# EAGLE design opam (EAGLE 6.6.0)
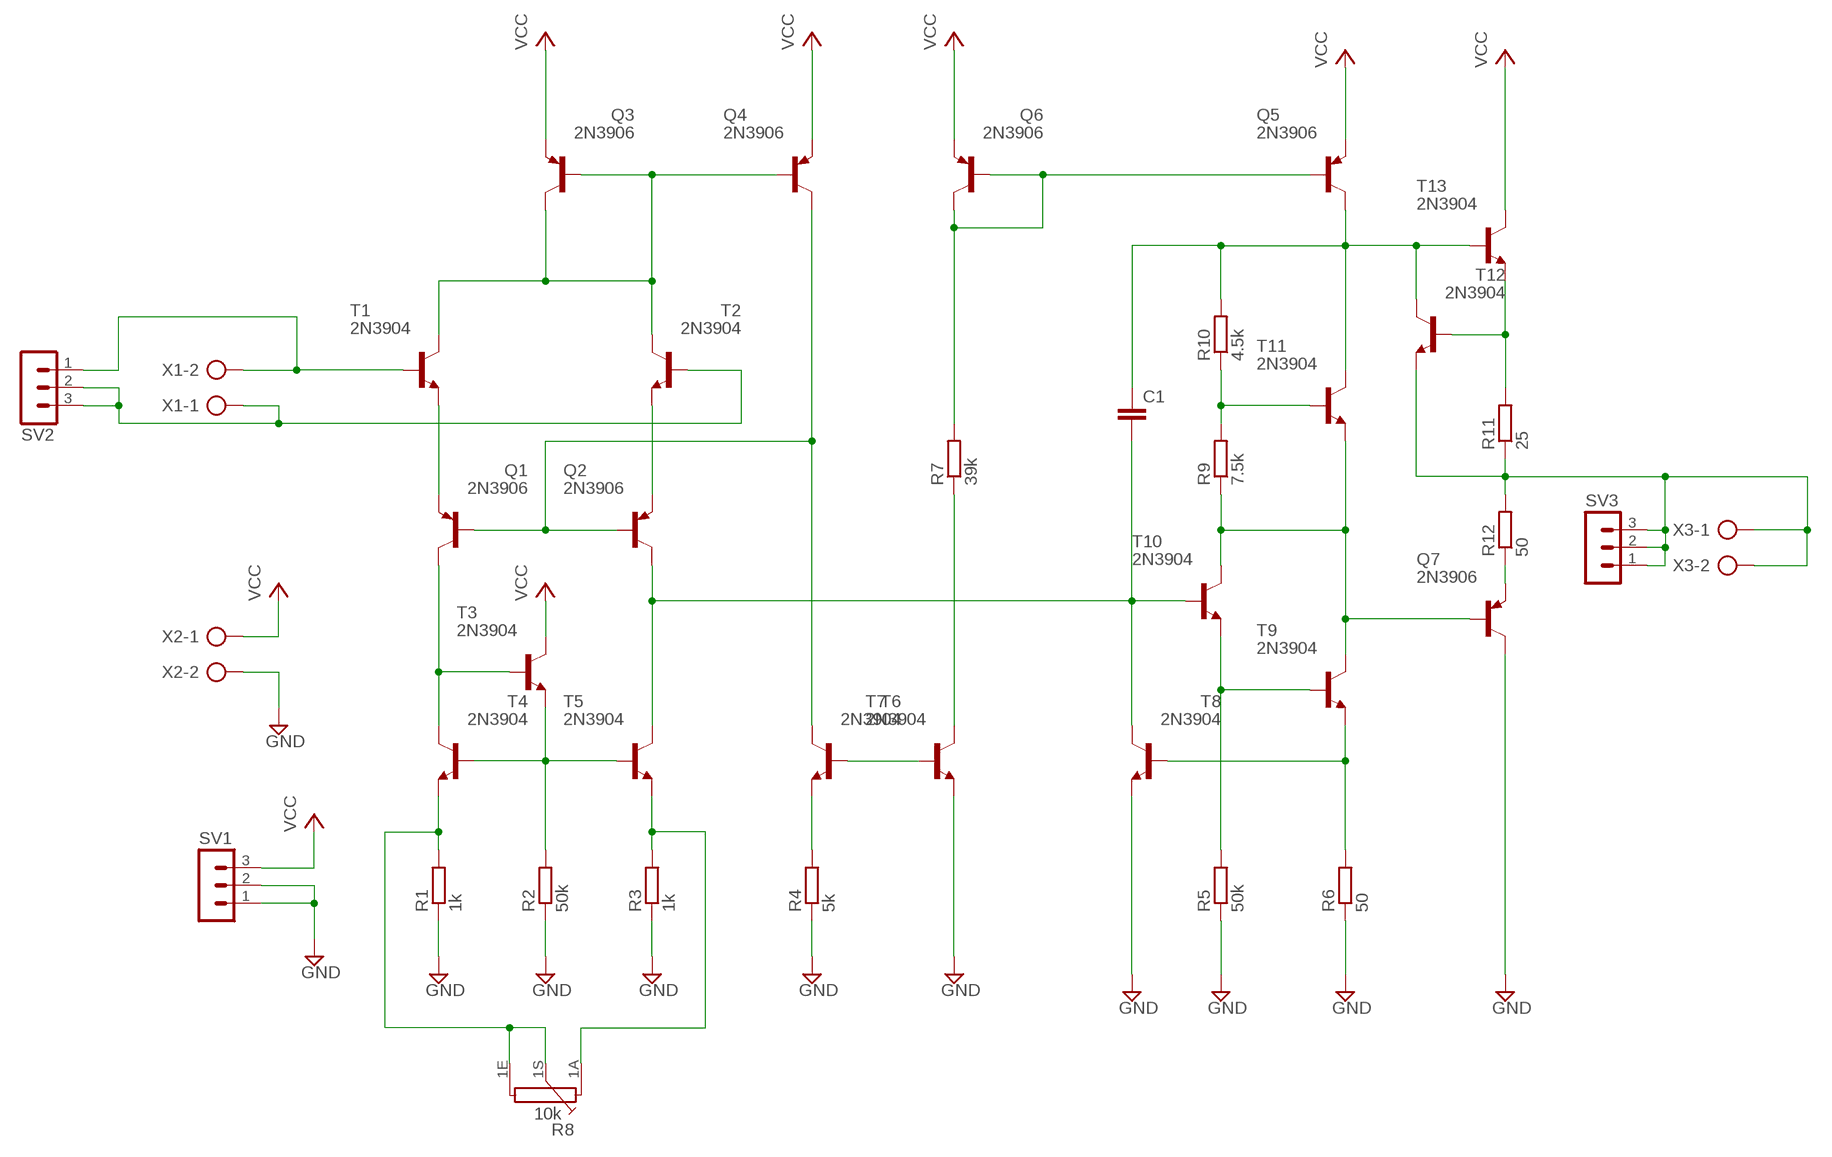
[diagram p0: schematic, sheet 1]

## Parts
C1  C2.5/5  [C2.5-5]
Q1  2N3906  [TO92]
Q2  2N3906  [TO92]
Q3  2N3906  [TO92]
Q4  2N3906  [TO92]
Q5  2N3906  [TO92]
Q6  2N3906  [TO92]
Q7  2N3906  [TO92]
R1  1k  R-EU_0309/12  [0309/12]
R2  50k  R-EU_0309/12  [0309/12]
R3  1k  R-EU_0309/12  [0309/12]
R4  5k  R-EU_0309/12  [0309/12]
R5  50k  R-EU_0309/12  [0309/12]
R6  50  R-EU_0309/12  [0309/12]
R7  39k  R-EU_0309/12  [0309/12]
R8  10k  PC16S  [PC16S]
R9  7.5k  R-EU_0309/12  [0309/12]
R10  4.5k  R-EU_0309/12  [0309/12]
R11  25  R-EU_0309/12  [0309/12]
R12  50  R-EU_0309/12  [0309/12]
SV1  MA03-1  [MA03-1]
SV2  MA03-1  [MA03-1]
SV3  MA03-1  [MA03-1]
T1  2N3904  [TO92]
T2  2N3904  [TO92]
T3  2N3904  [TO92]
T4  2N3904  [TO92]
T5  2N3904  [TO92]
T6  2N3904  [TO92]
T7  2N3904  [TO92]
T8  2N3904  [TO92]
T9  2N3904  [TO92]
T10  2N3904  [TO92]
T11  2N3904  [TO92]
T12  2N3904  [TO92]
T13  2N3904  [TO92]
X1  AK500/2-H  [AK500/2-H]
X2  AK500/2-H  [AK500/2-H]
X3  AK500/2-H  [AK500/2-H]

## Nets
GND: Q7.1(C) R1.1 R2.1 R3.1 R4.1 R5.1 R6.1 SV1.1 SV1.2 T7.3(E) T8.3(E) X2.2
N$1: R5.2 T9.2(B) T10.3(E)
N$2: R2.2 T3.3(E) T4.2(B) T5.2(B)
N$3: R3.2 R8.1A T5.3(E)
N$4: SV2.1 T1.2(B) X1.2
N$5: Q1.1(C) T3.2(B) T4.1(C)
N$6: Q1.3(E) T1.3(E)
N$7: Q2.3(E) T2.3(E)
N$8: Q1.2(B) Q2.2(B) Q4.1(C) T6.1(C)
N$9: Q3.1(C) Q3.2(B) Q4.2(B) T1.1(C) T2.1(C)
N$10: R6.2 T8.2(B) T9.3(E)
N$11: R1.2 R8.1E R8.1S T4.3(E)
N$12: Q7.3(E) R12.1
N$13: R4.2 T6.3(E)
N$14: T6.2(B) T7.2(B)
N$15: R7.1 T7.1(C)
N$16: Q5.2(B) Q6.1(C) Q6.2(B) R7.2
N$18: C1.2 Q2.1(C) T5.1(C) T8.1(C) T10.2(B)
N$19: Q7.2(B) R9.1 T9.1(C) T10.1(C) T11.3(E)
N$20: C1.1 Q5.1(C) R10.2 T11.1(C) T12.1(C) T13.2(B)
N$21: R11.2 T12.2(B) T13.3(E)
N$22: R9.2 R10.1 T11.2(B)
N$23: SV2.2 SV2.3 T2.2(B) X1.1
N$26: R11.1 R12.2 SV3.1 SV3.2 SV3.3 T12.3(E) X3.1 X3.2
VCC: Q3.3(E) Q4.3(E) Q5.3(E) Q6.3(E) SV1.3 T3.1(C) T13.1(C) X2.1

## Library data of the parts
C1 = capacitor-wima:C: CAPACITOR naming: grid - package width
Q1-Q7 = transistor-pnp:2N3906: PNP Transistor
R1-R7 R9-R12 = rcl:R-EU_: RESISTOR, European symbol
R8 = piher:PC16S: POTENTIOMETER single carbon potentiometer, 16 mm, S3ROH; OC_FARNELL: 4452940; OC_NEWARK: unknown
SV1-SV3 = con-lstb:MA03-1: PIN HEADER; OC_FARNELL: unknown; OC_NEWARK: unknown
T1-T13 = transistor:2N3904: NPN TRANSISTOR
X1-X3 = con-ptr500:AK500/2-H: CONNECTOR Aug. 2004 / PTR Meßtechnik: Die Bezeichnung der Serie AK505 wurde geändert. Es handelt sich hierbei um AK500 in horizontaler Ausführung.; OC_FARNELL: unknown; OC_NEWARK: unknown

## Board
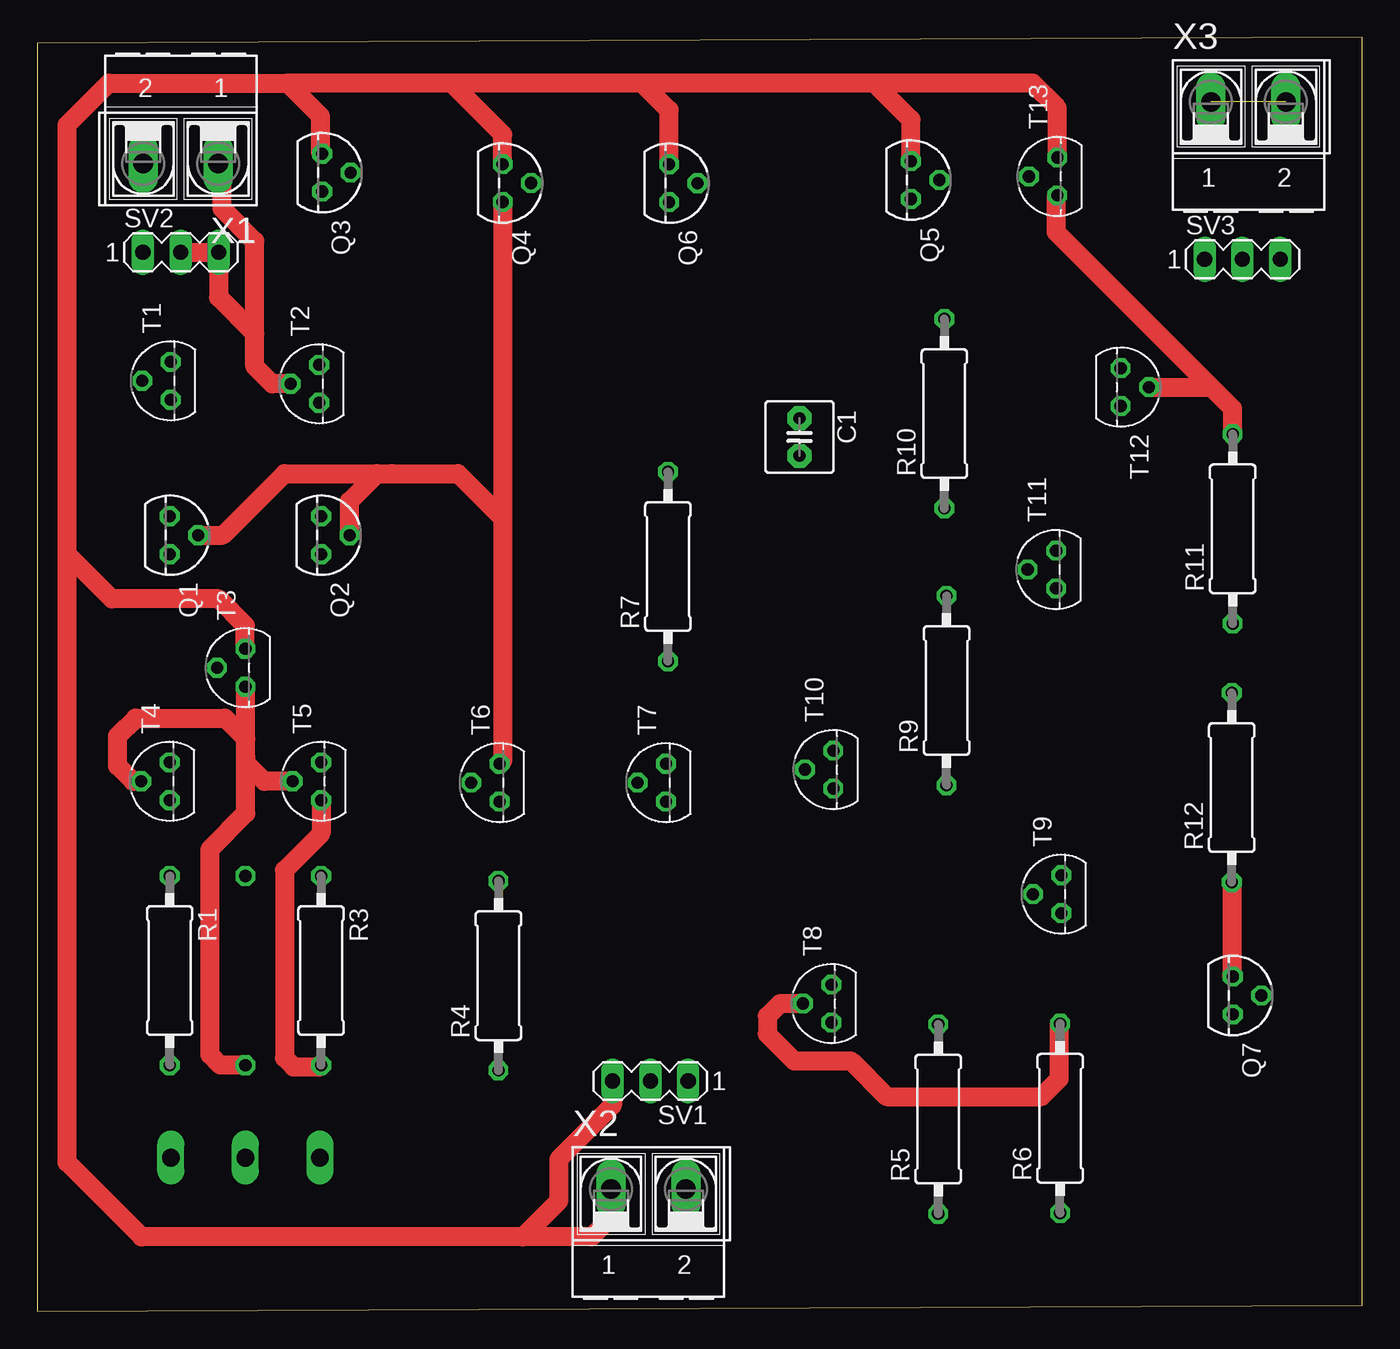
[diagram p1: board, top side]
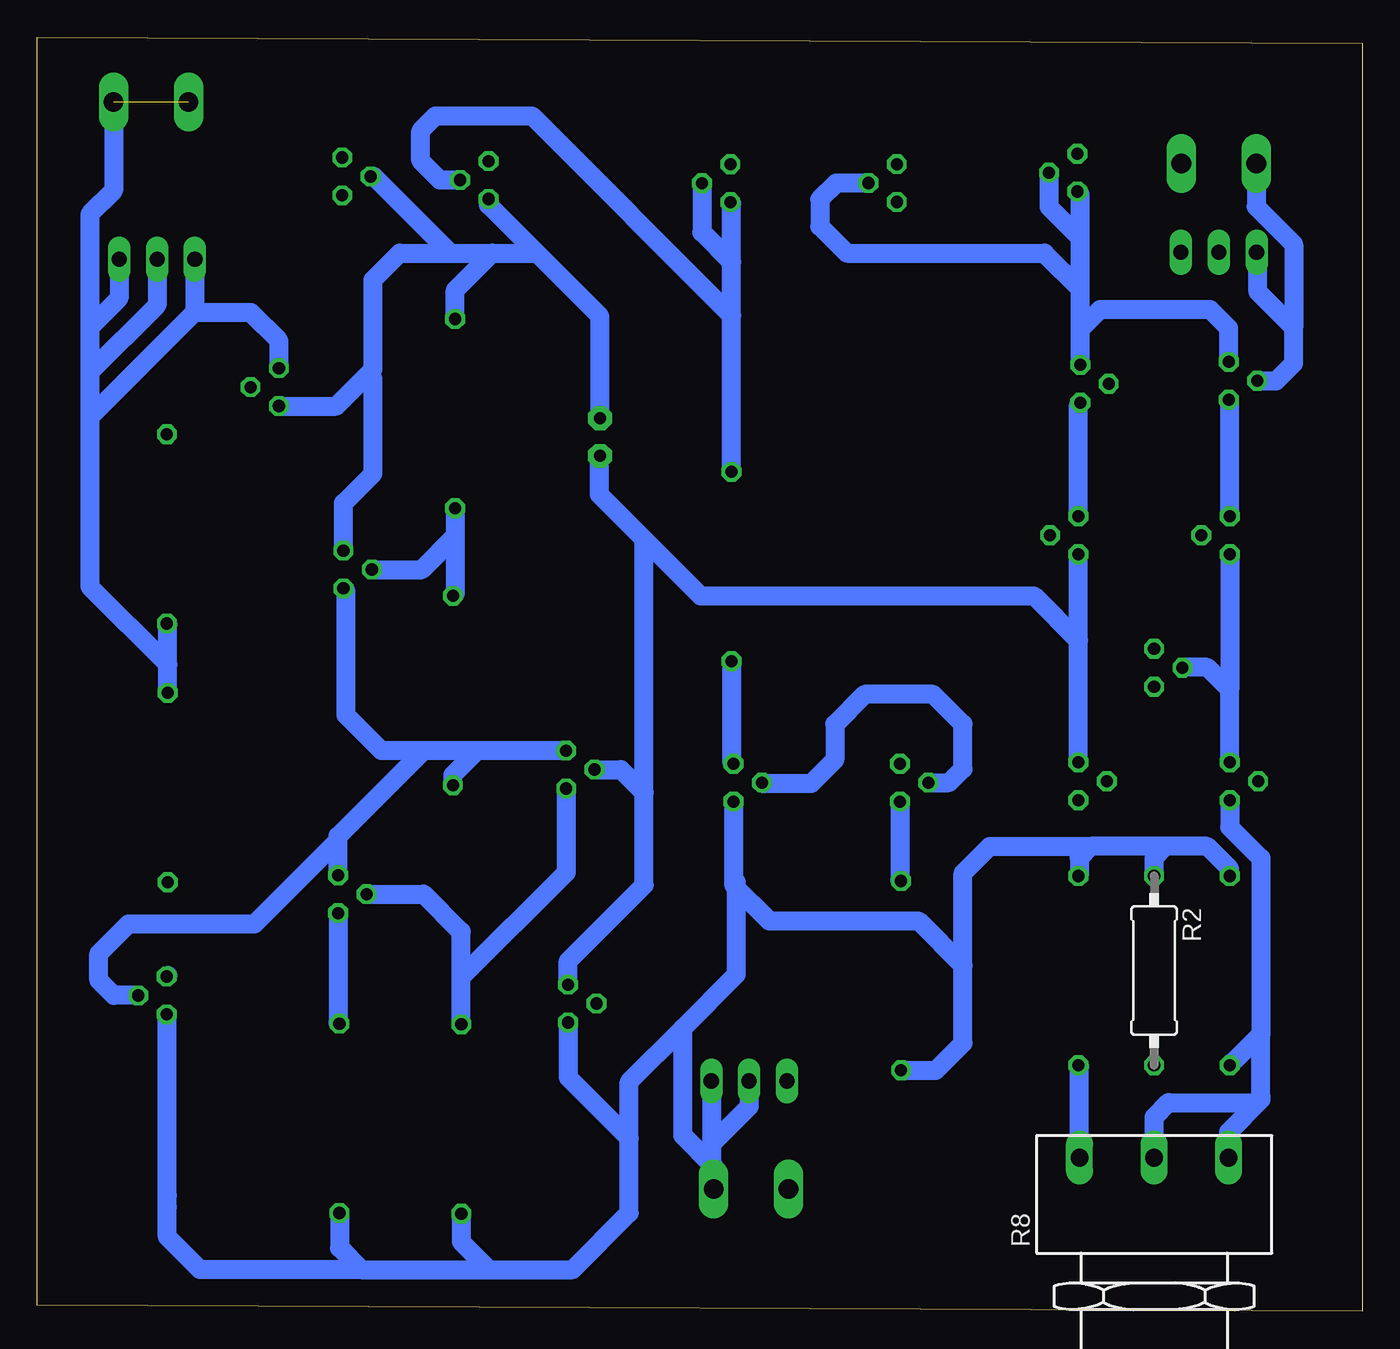
[diagram p2: board, bottom side, seen from below]

Size 88.93 x 85.48 mm. Coordinates in mm from the lower left corner, seen from the top.
Outline: 0,0 88.93,0.4 88.93,85.48 0,85.08 0,0
Copper layers (1*16): Top 0.035mm / dielectric 1.5mm / Bottom 0.035mm
Design rules "default": minimum track width 10mil, minimum drill 24mil, track to track 8mil, track to pad 8mil, pad to pad 8mil, via to via 8mil, smd to smd 8mil, copper to edge 40mil, drill to drill 8mil, minimum pad ring 10mil, minimum via ring 8mil, stop-mask expansion 4mil, vias tented up to drill 0mil, thermal gap 10mil

### Footprints (pad centres in the part's own frame; a part is rotated, then mirrored left to right if it is on the bottom)
C2.5-5 = drill 0.813 pad 1.6 octagon: 1 -1.27,0; 2 1.27,0
TO92 = drill 0.813 octagon: 1 1.27,0; 2 0,1.905; 3 -1.27,0
0309/12 = drill 0.813 octagon: 1 -6.35,0; 2 6.35,0
PC16S = drill 1.2 long: 1A -5,6.5; 1E 5,6.5; 1S 0,6.5
MA03-1 = drill 1.016 long: 1 -2.54,0; 2 0,0; 3 2.54,0
AK500/2-H = drill 1.321 long: 1 -2.515,0; 2 2.515,0

### Placement (x,y rotation side)
C1  51.16,58.66 270 top
Q1  8.89,52.07 270 top
Q2  19.05,52.07 270 top
Q3  19.12,76.4 270 top
Q4  31.24,75.7 270 top
Q5  58.64,75.9 270 top
Q6  42.41,75.69 270 top
Q7  80.24,21.19 270 top
R1  8.89,22.86 270 top
R2  13.97,22.86 270 bottom
R3  19.05,22.86 270 top
R4  30.95,22.52 90 top
R5  60.47,12.9 90 top
R6  68.65,12.95 90 top
R7  42.33,49.97 90 top
R8  13.97,3.81 0 bottom
R9  61.03,41.65 90 top
R10  60.88,60.23 90 top
R11  80.23,52.5 90 top
R12  80.17,35.14 90 top
SV1  41.15,15.45 180 top
SV2  9.63,71.05 0 top
SV3  80.89,70.58 0 top
T1  8.96,62.43 90 top
T2  18.92,62.23 90 top
T3  13.97,43.18 90 top
T4  8.89,35.56 90 top
T5  19.05,35.56 90 top
T6  31.03,35.47 90 top
T7  42.2,35.47 90 top
T8  53.3,20.65 90 top
T9  68.74,27.99 90 top
T10  53.43,36.35 90 top
T11  68.38,49.77 90 top
T12  72.71,62.01 270 top
T13  68.46,76.14 90 top
X1  9.63,77 180 top
X2  41.02,8.2 0 top
X3  81.29,81.14 0 top

### Tracks (layer width: path | path; a pad name or v marks a point on that pad's centre or on a via)
GND
  Bottom 1.27: R1.1 8.89,29.69 10.4,31.2 13.2,31.2 | 13.2,31.2 18.2,31.2 | 18.2,31.2 19,30.4 19,29.26 R3.1 | R2.1 13.97,30.43 13.2,31.2 | R4.1 28.63,16.17 26.8,18 26.8,23.2 | 26.8,23.2 26.8,29.4 25,31.2 18.2,31.2 | T7.3 42.2,29 | 42.2,29 42.2,28.6 39.8,26.2 29.8,26.2 26.8,23.2 | 45.6,19 45.6,11.8 43.53,9.73 X2.2 43.69,8.36 43.69,11.2 | 45.6,19 42,22.6 42,28.8 42.2,29 | SV1.1 43.69,11.2 | SV1.2 41.15,13.74 43.69,11.2 | 67.2,2.8 58.6,2.8 | 58.6,2.8 53,2.8 49.2,6.6 49.2,11.6 | 49.2,11.6 49.2,15.4 45.6,19 | T8.3 53.3,15.7 49.2,11.6 | R5.1 60.47,4.67 58.6,2.8 | Q7.1 80.24,7.8 | 80.24,7.8 80.24,7.04 80.2,7 | R6.1 68.65,4.25 67.2,2.8 | 67.2,2.8 78,2.8 80.2,5 80.2,7.76 80.24,7.8
N$1
  Bottom 1.27: R5.2 60.47,22.4 | 60.47,22.4 60.47,25.47 63,28 63.01,27.99 T9.2 | T10.3 53.43,29.44 60.47,22.4
N$2
  Top 1.27: T4.2 6.44,35.56 5.4,36.6 5.4,38.6 6.6,39.8 12.6,39.8 14,38.4 | 14,38.4 14,41.88 T3.3 | T5.2 15.24,35.56 14,36.8 | 14,36.8 14,37.2 14,38.4 | R2.2 12.29,16.51 11.6,17.2 11.6,31 14,33.4 14,36.8
N$3
  Top 1.27: T5.3 19.05,32.05 16.6,29.6 16.6,17 17.2,16.4 18.94,16.4 R3.2
  Bottom 1.27: R8.1A 18.97,16.43 R3.2
N$4
  Bottom 1.27: T1.2 5.77,62.43 4.6,63.6 4.6,65.2 4.6,66 | 4.6,66 7,68.4 7,71.14 | 7,71.6 7,71.14 | 7,71.14 SV2.1 | X1.2 7.12,74.11 4.6,71.6 4.6,66
N$5
  Bottom 1.27: T4.1 8.89,40.8 8.89,41.69 | 8.89,41.69 10.4,43.2 12.04,43.2 T3.2 | Q1.1 8.89,41.69
N$6
  Bottom 1.27: Q1.3 8.89,61.09 T1.3
N$7
  Bottom 1.27: Q2.3 19.05,60.83 T2.3
N$8
  Top 1.27: Q4.1 31.24,53.2 | 31.24,53.2 31.24,36.95 T6.1 | Q1.2 12.47,52.07 16.6,56.2 22.8,56.2 | Q2.2 20.95,54.35 22.8,56.2 | 22.8,56.2 23.8,56.2 28.24,56.2 31.24,53.2
N$9
  Bottom 1.27: T1.1 8.96,65.96 10.2,67.2 17.6,67.2 18.92,65.88 | T2.1 18.92,65.88 | 18.92,65.88 18.92,68.6 | 18.92,68.6 18.92,72 | 18.92,72 18.92,74.93 Q3.1 | Q3.2 21.02,74.11 18.92,72 | Q4.2 35.3,75.7 36.4,74.6 36.4,72.8 34.6,71 21.32,71 18.92,68.6
N$10
  Top 1.27: T8.2 49.85,20.65 49,19.8 49,18.6 50.8,16.8 54.6,16.8 57,14.4 67.4,14.4 68.6,15.6 68.6,19.25 R6.2
  Bottom 1.27: T9.3 68.74,19.39 R6.2
N$11
  Bottom 1.27: T4.3 8.89,32.49 6.8,30.4 6.8,18.6 | 6.8,18.6 R1.2 | R8.1E 8.97,12.03 6.8,14.2 6.8,14.4 | 6.8,14.4 6.8,18.6 | R8.1S 13.97,13.03 13,14 7.2,14 6.8,14.4
N$12
  Top 1.27: R12.1 80.17,22.53 Q7.3
  Bottom 1.27: 80.17,22.53 Q7.3
N$13
  Bottom 1.27: T6.3 31.03,28.95 R4.2
N$14
  Bottom 1.27: T6.2 27.73,35.47 26.8,36.4 26.8,39.4 28.8,41.4 33.4,41.4 35.4,39.4 35.4,37 37,35.4 40.23,35.4 T7.2
N$15
  Bottom 1.27: R7.1 42.33,36.87 T7.1
N$16
  Bottom 1.27: R7.2 42.33,66.8 | 42.33,66.8 42.33,70.4 | 42.33,70.4 42.33,74.34 Q6.1 | Q6.2 44.31,72.39 42.33,70.4 | Q5.2 61.9,75.9 63.2,77.2 63.2,79.2 62.2,80.2 55.73,80.2 42.33,66.8
N$18
  Bottom 1.27: T5.1 19.05,45 | 19.05,45 Q2.1 | T8.1 53.3,23.5 48.2,28.6 48.2,34.8 | 48.2,34.8 48.2,51.8 | 48.2,51.8 51.2,54.8 51.2,57.35 C1.2 | T10.2 49.75,36.35 48.2,34.8 | 48.2,51.8 44.4,48 22.05,48 19.05,45
N$19
  Bottom 1.27: T10.1 59.4,37.62 | 59.4,37.62 63,37.62 | 63,37.62 65.82,37.62 68.2,40 68.2,48.32 T11.3 | T9.1 68.74,31.6 | 68.74,31.6 68.74,31.88 63,37.62 | R9.1 61.03,35.99 59.4,37.62 | Q7.2 83.79,21.19 84.8,22.2 84.8,24 82.8,26 74.34,26 68.74,31.6
N$20
  Bottom 1.27: C1.1 51.16,66.76 55.4,71 | T13.2 66.34,76.14 61.2,71 | 61.2,71 58.4,71 | 58.4,71 55.4,71 | Q5.1 58.64,74.24 55.4,71 | R10.2 60.88,68.52 58.4,71 | T12.1 68.86,60.74 66.7,62.9 | 66.7,62.9 66.4,63.2 66.4,69.2 64.6,71 61.2,71 | T11.1 68.38,54.22 66.4,56.2 66.4,62.6 66.7,62.9
N$21
  Top 1.27: R11.2 80.23,60.57 78.9,61.9 78.79,62.01 | 78.79,62.01 68.4,72.4 68.4,74.81 T13.3 | T12.2 78.79,62.01
N$22
  Bottom 1.27: R10.1 60.88,52 | 60.88,52 60.88,48.15 R9.2 | T11.2 63.11,49.77 60.88,52
N$23
  Top 1.27: T2.2 15.77,62.23 14.6,63.4 14.6,65.6 | 14.6,65.6 14.6,71.8 12.4,74 12.4,76.75 X1.1 | SV2.2 SV2.3 12.17,68.03 14.6,65.6
N$26  (1 unrouted)
  Bottom 1.27: R12.2 80.17,43.4 | 80.17,43.4 80.17,46.09 R11.1 | X3.2 83.81,75.19 85.4,73.6 85.4,66 | 85.4,66 85.4,63 | 85.4,63 85.4,60 | 85.4,60 85.4,48.63 80.17,43.4 | SV3.3 83.43,67.97 85.4,66 | SV3.2 80.89,67.51 85.4,63 | SV3.1 78.35,67.05 78.4,67 | 85.4,60 78.9,66.5 78.4,67 | T12.3 72.71,65.11 74.6,67 78.4,67
VCC
  Top 1.27: T3.1 13.97,46.03 12.2,47.8 5,47.8 2,50.8 | 2,50.8 2,79.6 4.8,82.4 16.8,82.4 | 16.8,82.4 19,80.2 19,77.79 Q3.3 | Q4.3 31.24,78.96 27.8,82.4 | 27.8,82.4 16.8,82.4 | Q6.3 42.41,80.59 40.6,82.4 | 40.6,82.4 27.8,82.4 | X2.1 38.51,6.3 37.2,5 32.6,5 | 32.6,5 7,5 2,10 2,50.8 | SV1.3 38.61,13.81 35,10.2 35,7.4 32.6,5 | 56.2,82.4 55.8,82.4 40.6,82.4 | Q5.3 58.64,79.96 56.2,82.4 | T13.1 68.46,80.74 66.8,82.4 56.2,82.4